# Altium project LegBoard.PrjPcb
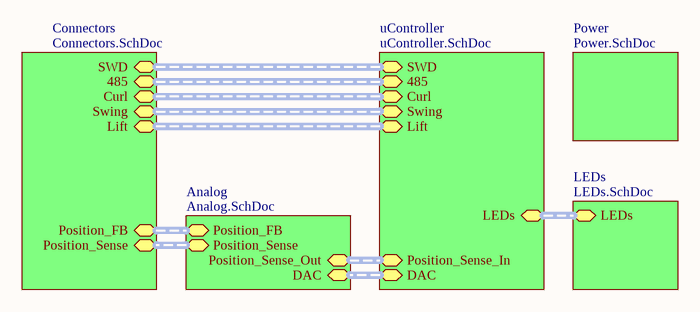
[diagram p0: Main.SchDoc]
5 sheets, 78 parts. Net scope: hierarchical (ports join the sheet entries above them; power ports are global).
Board file: LegBoard.PcbDoc
Sheets:
  Main.SchDoc
    Connectors = Connectors.SchDoc
    uController = uController.SchDoc
    LEDs = LEDs.SchDoc
    Analog = Analog.SchDoc

## Sheet Main.SchDoc
size A

### Sub-sheets
Analog = Analog.SchDoc: Position_FB (harness FB_Harness), Position_Sense (harness FB_Harness), Position_Sense_Out (harness FB_Harness), DAC
Connectors = Connectors.SchDoc: SWD (harness SWD_Harness), Position_FB (harness FB_Harness), Curl (harness Actuator_Harness), Swing (harness Actuator_Harness), Lift (harness Actuator_Harness), 485 (harness 485_Harness), Position_Sense (harness FB_Harness)
LEDs = LEDs.SchDoc: LEDs (harness LED_Harness)
Power = Power.SchDoc (file not in this document): no entries
uController = uController.SchDoc: SWD (harness SWD_Harness), Curl (harness Actuator_Harness), Swing (harness Actuator_Harness), Lift (harness Actuator_Harness), 485 (harness 485_Harness), LEDs (harness LED_Harness), Position_Sense_In, DAC (harness DAC_Harness)

### Buses and harness runs
harness sheet Analog/DAC = sheet uController/DAC
harness sheet Analog/Position_FB = sheet Connectors/Position_FB
harness sheet Analog/Position_Sense = sheet Connectors/Position_Sense
harness sheet Analog/Position_Sense_Out = sheet uController/Position_Sense_In
harness sheet Connectors/485 = sheet uController/485
harness sheet Connectors/Curl = sheet uController/Curl
harness sheet Connectors/Lift = sheet uController/Lift
harness sheet Connectors/SWD = sheet uController/SWD
harness sheet Connectors/Swing = sheet uController/Swing
harness sheet LEDs/LEDs = sheet uController/LEDs

## Sheet Connectors.SchDoc
size A
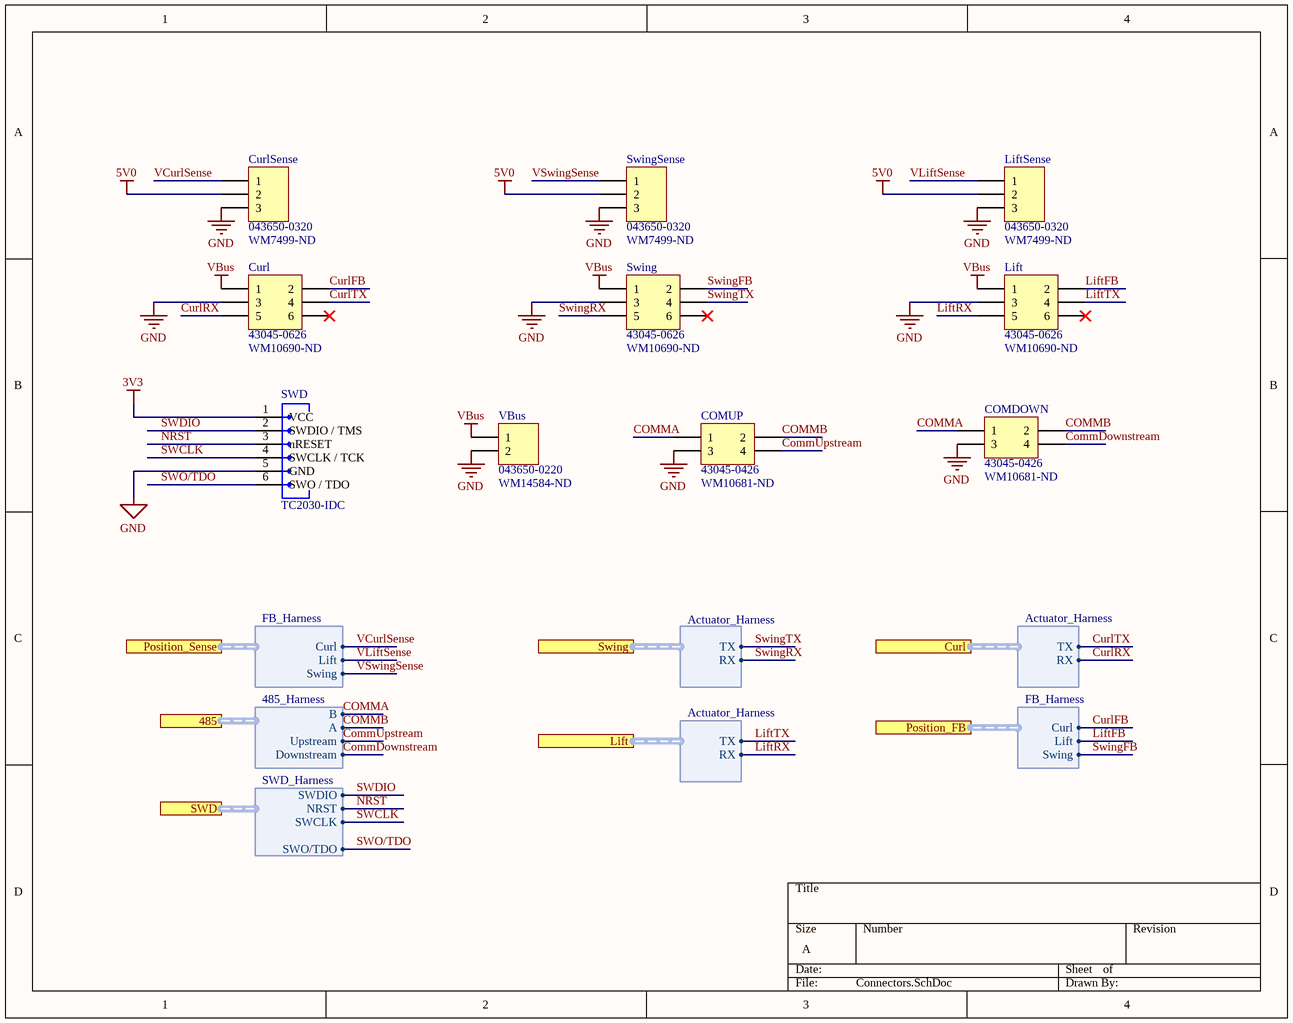
[diagram p1: Connectors.SchDoc]

### Parts
COMDOWN  43045-0426  Vendor PN: WM10681-ND  [43045-0426]
COMUP  43045-0426  Vendor PN: WM10681-ND  [43045-0426]
Curl  43045-0626  Vendor PN: WM10690-ND  [43045-0626]
CurlSense  043650-0320  Vendor PN: WM7499-ND  [43650-0320]
Lift  43045-0626  Vendor PN: WM10690-ND  [43045-0626]
LiftSense  043650-0320  Vendor PN: WM7499-ND  [43650-0320]
SWD  TC2030-IDC  [TC2030-MCP]
Swing  43045-0626  Vendor PN: WM10690-ND  [43045-0626]
SwingSense  043650-0320  Vendor PN: WM7499-ND  [43650-0320]
VBus  043650-0220  Vendor PN: WM14584-ND  [43650-0220]

### Ports
485 (harness 485_Harness), Curl (harness Actuator_Harness), Lift (harness Actuator_Harness), Position_FB (harness FB_Harness), Position_Sense (harness FB_Harness), SWD (harness SWD_Harness), Swing (harness Actuator_Harness)

### Harnesses
SWD_Harness: NRST, SWDIO, SWCLK, SWO/TDO
Actuator_Harness: RX, TX
FB_Harness: Lift, Curl, Swing
485_Harness: A, B, Upstream, Downstream

### Nets
3V3: SWD.1(VCC)
5V0: CurlSense.2 LiftSense.2 SwingSense.2
GND: COMDOWN.3 COMUP.3 Curl.3 CurlSense.3 Lift.3 LiftSense.3 SWD.5(GND) Swing.3 SwingSense.3 VBus.2
VBus: Curl.1 Lift.1 Swing.1 VBus.1
COMMA: COMDOWN.1 COMUP.1 ; port 485.B
COMMB: COMDOWN.2 COMUP.2 ; port 485.A
CommDownstream: COMDOWN.4 ; port 485.Downstream
CommUpstream: COMUP.4 ; port 485.Upstream
CurlFB: Curl.2 ; port Position_FB.Curl
CurlRX: Curl.5 ; port Curl.RX
CurlTX: Curl.4 ; port Curl.TX
LiftFB: Lift.2 ; port Position_FB.Lift
LiftRX: Lift.5 ; port Lift.RX
LiftTX: Lift.4 ; port Lift.TX
NRST: SWD.3(nRESET) ; port SWD.NRST
SWCLK: SWD.4(SWCLK_/_TCK) ; port SWD.SWCLK
SWDIO: SWD.2(SWDIO_/_TMS) ; port SWD.SWDIO
SwingFB: Swing.2 ; port Position_FB.Swing
SwingRX: Swing.5 ; port Swing.RX
SwingTX: Swing.4 ; port Swing.TX
SWO/TDO: SWD.6(SWO_/_TDO) ; port SWD.SWO/TDO
VCurlSense: CurlSense.1 ; port Position_Sense.Curl
VLiftSense: LiftSense.1 ; port Position_Sense.Lift
VSwingSense: SwingSense.1 ; port Position_Sense.Swing

Not connected (* = marked no-connect by the designer): Curl 6*; Lift 6*; Swing 6*

### Library data of the parts
COMDOWN COMUP = Header 2X2: Header, 2-Pin, Dual row; LatestRevisionDate: 17-Jul-2002; LatestRevisionNote: Re-released for DXP Platform.; Publisher: Altium Limited
Curl Lift Swing = Header 3X2: Header, 3-Pin, Dual row; LatestRevisionDate: 17-Jul-2002; LatestRevisionNote: Re-released for DXP Platform.; Publisher: Altium Limited
CurlSense LiftSense SwingSense = Header 3: Header, 3-Pin; LatestRevisionDate: 17-Jul-2002; LatestRevisionNote: Re-released for DXP Platform.; Publisher: Altium Limited
SWD = TC2030-IDC: Connector, Pogo-Pin, ARM Cortex; Manufacturer 1: Tag-Connect; Category: Connectors; Manufacturer Part Number 1: TC2030-IDC; DNP: DNP
VBus = Header 2: Header, 2-Pin; LatestRevisionDate: 17-Jul-2002; LatestRevisionNote: Re-released for DXP Platform.; Publisher: Altium Limited

## Sheet uController.SchDoc
size A
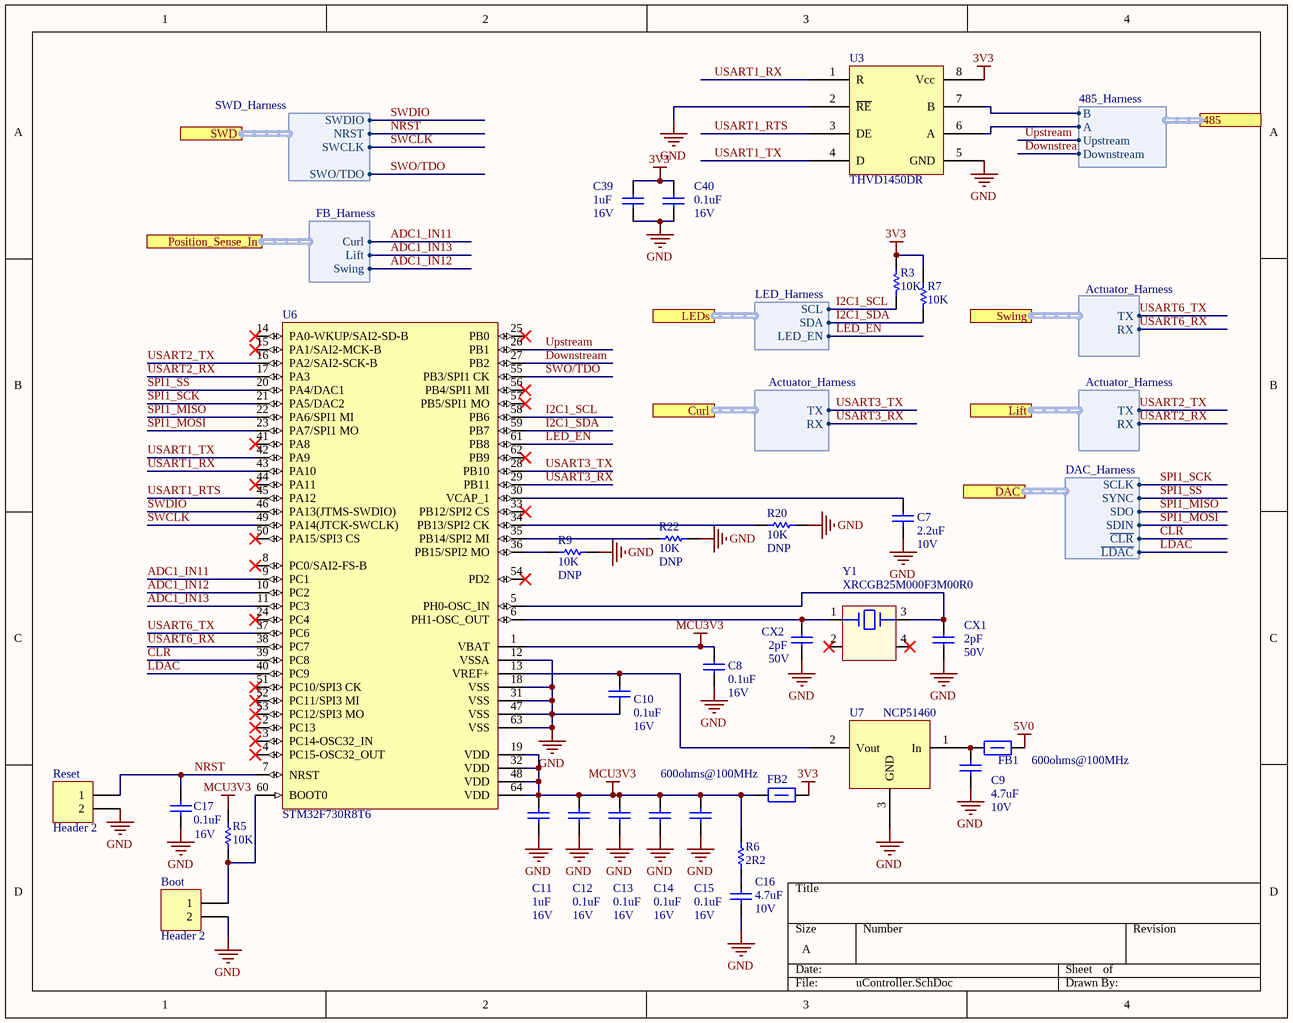
[diagram p2: uController.SchDoc]

### Parts
(Parts that share a designator on the sheet are numbered #1, #2 ... from top to bottom, then left to right.)
Boot  Header 2  [HDR1X2]
C7  2.2uF  Voltage - Rated: 10V  [CAPC1005(0402)N]
C8  0.1uF  Voltage - Rated: 16V  [CAPC1005(0402)N]
C9  4.7uF  Voltage - Rated: 10V  [CAPC1005(0402)N]
C10  0.1uF  Voltage - Rated: 16V  [CAPC1005(0402)N]
C11  1uF  Voltage - Rated: 16V  [CAPC1005(0402)N]
C12  0.1uF  Voltage - Rated: 16V  [CAPC1005(0402)N]
C13  0.1uF  Voltage - Rated: 16V  [CAPC1005(0402)N]
C14  0.1uF  Voltage - Rated: 16V  [CAPC1005(0402)N]
C15  0.1uF  Voltage - Rated: 16V  [CAPC1005(0402)N]
C16  4.7uF  Voltage - Rated: 10V  [CAPC1005(0402)N]
C17  0.1uF  Voltage - Rated: 16V  [CAPC1005(0402)N]
C39  1uF  Voltage - Rated: 16V  [CAPC1005(0402)N]
C40  0.1uF  Voltage - Rated: 16V  [CAPC1005(0402)N]
CX1  2pF  Voltage - Rated: 50V  [CAPC1005(0402)N]
CX2  2pF  Voltage - Rated: 50V  [CAPC1005(0402)N]
FB1  600ohms@100MHz  [INDC1608X100N]
FB2  600ohms@100MHz  [INDC1608X100N]
R3  10K  [RESC1005(0402)N]
R5  10K  [RESC1005(0402)N]
R6  2R2  [RESC1005(0402)N]
R7  10K  [RESC1005(0402)N]
R9  value 10K  [0402]  (hidden comment: Res1)
R20#1  value 10K  [0402]  (hidden comment: Res1)
R22  value 10K  [0402]  (hidden comment: Res1)
Reset  Header 2  [HDR1X2]
U3  THVD1450DR  [SOIC8]
U6  STM32F730R8T6  [STM-LQFP64_V]
U7  NCP51460  [SOT95P237X111-3N]
Y1  XRCGB25M000F3M00R0  [XTAL2x1.6-XRCGB]

### Ports
485 (harness 485_Harness), Curl (harness Actuator_Harness), DAC (harness DAC_Harness), LEDs (harness LED_Harness), Lift (harness Actuator_Harness), Position_Sense_In (harness FB_Harness), SWD (harness SWD_Harness), Swing (harness Actuator_Harness)

### Harnesses
SWD_Harness: NRST, SWDIO, SWCLK, SWO/TDO
485_Harness: A, B, Upstream, Downstream
Actuator_Harness: RX, TX
LED_Harness: SDA, SCL, LED_EN
FB_Harness: Lift, Curl, Swing
DAC_Harness: SDIN, SDO, SCLK, SYNC, ~{CLR}, ~{LDAC}

### Nets
3V3: C39.2 C40.2 FB2.2 R3.2 R7.2 U3.8(Vcc)
5V0: FB1.2
GND: Boot.2 C7.1 C8.1 C9.1 C10.1 C11.1 C12.1 C13.1 C14.1 C15.1 C16.1 C17.1 C39.1 C40.1 CX1.1 CX2.1 R9.2 R20#1.2 R22.2 Reset.2 U3.2(~{RE}) U3.5(GND) U6.12(VSSA) U6.18(VSS) U6.31(VSS) U6.47(VSS) U6.63(VSS) U7.3(GND)
MCU3V3: C8.2 C11.2 C12.2 C13.2 C14.2 C15.2 FB2.1 R5.2 R6.2 U6.1(VBAT) U6.19(VDD) U6.32(VDD) U6.48(VDD) U6.64(VDD)
ADC1_IN11: U6.9(PC1) ; port Position_Sense_In.Curl
ADC1_IN12: U6.10(PC2) ; port Position_Sense_In.Swing
ADC1_IN13: U6.11(PC3) ; port Position_Sense_In.Lift
~{CLR}: U6.39(PC8) ; port DAC.~{CLR}
COMMA: U3.7(B) ; port 485.B
COMMB: U3.6(A) ; port 485.A
Downstream: U6.27(PB2) ; port 485.Downstream  [project net CommDownstream]
I2C1_SCL: R3.1 U6.58(PB6) ; port LEDs.SCL
I2C1_SDA: R7.1 U6.59(PB7) ; port LEDs.SDA
~{LDAC}: U6.40(PC9) ; port DAC.~{LDAC}  [project net DAC_~{LDAC}]
LED_EN: U6.61(PB8) ; port LEDs.LED_EN
NRST: C17.2 Reset.1 U6.7(NRST) ; port SWD.NRST
SPI1_MISO: U6.22(PA6/SPI1_MI) ; port DAC.SDO  [project net DAC_SDO]
SPI1_MOSI: U6.23(PA7/SPI1_MO) ; port DAC.SDIN  [project net DAC_DIN]
SPI1_~{SS}: U6.20(PA4/DAC1) ; port DAC.SYNC  [project net DAC_SYNC]
SPI1_SCK: U6.21(PA5/DAC2) ; port DAC.SCLK  [project net DAC_SCLK]
SWCLK: U6.49(PA14(JTCK-SWCLK)) ; port SWD.SWCLK
SWDIO: U6.46(PA13(JTMS-SWDIO)) ; port SWD.SWDIO
SWO/TDO: U6.55(PB3/SPI1_CK) ; port SWD.SWO/TDO
Upstream: U6.26(PB1) ; port 485.Upstream  [project net CommUpstream]
USART1_RTS: U3.3(DE) U6.45(PA12)
USART1_RX: U3.1(R) U6.43(PA10)
USART1_TX: U3.4(D) U6.42(PA9)
USART2_RX: U6.17(PA3) ; port Lift.RX  [project net LiftRX]
USART2_TX: U6.16(PA2/SAI2-SCK-B) ; port Lift.TX  [project net LiftTX]
USART3_RX: U6.29(PB11) ; port Curl.RX  [project net CurlRX]
USART3_TX: U6.28(PB10) ; port Curl.TX  [project net CurlTX]
USART6_RX: U6.38(PC7) ; port Swing.RX  [project net SwingRX]
USART6_TX: U6.37(PC6) ; port Swing.TX  [project net SwingTX]
NetBoot_1: Boot.1 R5.1 U6.60(BOOT0)
NetC7_2: C7.2 U6.30(VCAP_1)
NetC9_2: C9.2 FB1.1 U7.1(In)
NetC10_2: C10.2 U6.13(VREF+) U7.2(Vout)
NetC16_2: C16.2 R6.1
NetCX1_2: CX1.2 U6.5(PH0-OSC_IN) Y1.3(X3)
NetCX2_2: CX2.2 U6.6(PH1-OSC_OUT) Y1.1(X1)
NetR9_1: R9.1 U6.36(PB15/SPI2_MO)
NetR20#1_1: R20#1.1 U6.34(PB13/SPI2_CK)
NetR22_1: R22.1 U6.35(PB14/SPI2_MI)

Not connected (* = marked no-connect by the designer): U6 2(PC13)* 3(PC14-OSC32_IN)* 4(PC15-OSC32_OUT)* 8(PC0/SAI2-FS-B)* 14(PA0-WKUP/SAI2-SD-B)* 15(PA1/SAI2-MCK-B)* 24(PC4)* 25(PB0)* 33(PB12/SPI2_CS)* 41(PA8)* 44(PA11)* 50(PA15/SPI3_CS)* 51(PC10/SPI3_CK)* 52(PC11/SPI3_MI)* 53(PC12/SPI3_MO)* 54(PD2)* 56(PB4/SPI1_MI)* 57(PB5/SPI1_MO)* 62(PB9)*; Y1 2(GND)* 4(GND)*

### Library data of the parts
Boot Reset = Header 2: Header, 2-Pin; LatestRevisionDate: 17-Jul-2002; LatestRevisionNote: Re-released for DXP Platform.; Publisher: Altium Limited; DNP: DNP
C7 = CAP: Manufacturer 1: Murata; Manufacturer Part Number 1: GRM155R61A225KE95D; Temperature Coefficient: X5R; Tolerance: ±10%; Level: 1; Vendor PN: 490-10451-1-ND; RoHS: RoHS Compliant; Category: Capacitors; Capacitance: 2.2uF; Mounting Type: Surface Mount, MLCC; Operating Temperature: -55°C ~ 85°C; Package / Case: 0402 (1005 Metric); Size / Dimension: 0.039" L x 0.020" W (1.00mm x 0.50mm); Thickness (Max): 0.022" (0.55mm)
C8 = CAP: Manufacturer 1: Murata; Manufacturer Part Number 1: GRM155R61C104KA88D; Temperature Coefficient: X5R; Tolerance: ±10%; Level: 1; Vendor PN: 490-5415-1-ND; RoHS: RoHS Compliant; Category: Capacitors; Capacitance: 0.1uF; Mounting Type: Surface Mount, MLCC; Operating Temperature: -55°C ~ 85°C; Package / Case: 0402 (1005 Metric); Size / Dimension: 0.039" L x 0.020" W (1.00mm x 0.50mm); Thickness (Max): 0.022" (0.55mm)
C9 C16 = CAP: Manufacturer 1: Murata; Manufacturer Part Number 1: GRM155R61A475MEAAD; Temperature Coefficient: X5R; Tolerance: ±10%; Level: 1; Vendor PN: 490-14306-1-ND; RoHS: RoHS Compliant; Category: Capacitors; Capacitance: 4.7uF; Mounting Type: Surface Mount, MLCC; Operating Temperature: -55°C ~ 85°C; Package / Case: 0402 (1005 Metric); Size / Dimension: 0.039" L x 0.020" W (1.00mm x 0.50mm); Thickness (Max): 0.022" (0.55mm)
C10 C12-C15 C17 C40 = CAP: CAP CER 0.1UF 16V X5R 0402; Manufacturer 1: Murata; Manufacturer Part Number 1: GRM155R61C104KA88D; Tolerance: ±10%; Level: 1; Vendor PN: 490-5415-1-ND; Temperature Coefficient: X5R; RoHS: RoHS Compliant; Category: Capacitors; Capacitance: 0.1uF; Mounting Type: Surface Mount, MLCC; Operating Temperature: -55°C ~ 85°C; Package / Case: 0402 (1005 Metric); Size / Dimension: 0.039" L x 0.020" W (1.00mm x 0.50mm); Thickness (Max): 0.022" (0.55mm)
C11 C39 = CAP: Manufacturer 1: Samsung; Manufacturer Part Number 1: CL05A105KO5NNNC; Tolerance: ±10%; Level: 1; Vendor PN: 1276-1067-1-ND; RoHS: RoHS Compliant; Category: Capacitors; Capacitance: 1uF; Mounting Type: Surface Mount, MLCC; Operating Temperature: -55°C ~ 85°C; Package / Case: 0402 (1005 Metric); Size / Dimension: 0.039" L x 0.020" W (1.00mm x 0.50mm); Thickness (Max): 0.022" (0.55mm)
CX1 CX2 = CAP: CAP C0G/NP0; Manufacturer 1: Yageo; Manufacturer Part Number 1: CC0402CRNPO9BN2R0; Temperature Coefficient: X5R; Tolerance: ±10%; Level: 1; Vendor PN: 311-1006-1-ND; RoHS: RoHS Compliant; Category: Capacitors; Capacitance: 2pF; Mounting Type: Surface Mount, MLCC; Operating Temperature: -55°C ~ 85°C; Package / Case: 0402 (1005 Metric); Size / Dimension: 0.039" L x 0.020" W (1.00mm x 0.50mm); Thickness (Max): 0.022" (0.55mm)
FB1 FB2 = IND-FERRITE: Inductor, ferrite bead, 1608; Manufacturer 1: Murata; Manufacturer Part Number 1: BLM18KG601SN1D; Tolerance: 20%; DC Resistance (DCR): 150mR; Max DC Current: 1.3A; Test Frequency: 100MHz; Vendor PN: 490-5258-1-ND; Case/Package: 0603; Case Code (Metric): 1608; Impedance: 600ohms@100MHz; Termination: SMD/SMT; Composition: ferrite; Lead Free: Lead Free; Category: inductors; Package / Case: 0603 (1608 Metric)
R3 R5 R7 = RES: Resistor, Chip; Manufacturer 1: Stackpole; Manufacturer Part Number 1: RMCF0402FT10K0; Level: 1; Vendor PN: RMCF0402FT10K0CT-ND; Category: Resistors; Number of Terminations: 2; Composition: -; Power (Watts): -; Resistance: 10K; Temperature Coefficient: -; Tolerance: -; Package / Case: 0402 (1005 Metric)
R6 = RES: Resistor, Chip; Manufacturer 1: Stackpole; Manufacturer Part Number 1: RMCF0402FT2R20; Level: 1; Vendor PN: RMCF0402FT2R20CT-ND; Category: Resistors; Number of Terminations: 2; Composition: -; Power (Watts): -; Resistance: 2R2; Temperature Coefficient: -; Tolerance: -; Package / Case: 0402 (1005 Metric)
R9 R20#1 R22 = Res1: Resistor; Vendor PN: RMCF0402FT10K0CT-ND; Published: 8-Jun-2000; LatestRevisionDate: 17-Jul-2002; LatestRevisionNote: Re-released for DXP Platform.; PackageReference: AXIAL-0.3; Publisher: Altium Limited; PackageDescription: Axial Device, Thru-Hole; 2 Leads; 0.3 in Pin Spacing; DNP: DNP
U3 = THVD1450DR: Vendor PN: 296-50395-1-ND
U6 = STM32F730R8T6: IC, Cortex-M7 32b MCU+FPU, 462DMIPS, 64KB Flash / /256+16+4KB RAM, 64 pin LQFP; Manufacturer 1: STMicro; Vendor PN: 497-18103-ND; Manufacturer Part Number 1: STM32F730R8T6; Category: ICs
U7 = NCP51460: Vendor PN: NCP51460SN33T1GOSCT-ND
Y1 = XTAL01: Crystal, Murata  XRCGB25M000F3M00R0; Value: 25MHz; Vendor Pn: 490-5578-1-ND; Manufacturer 1: Murata; Manufacturer Part Number 1: XRCGB25M000F3M00R0; Category: frequency control

## Sheet LEDs.SchDoc
size A
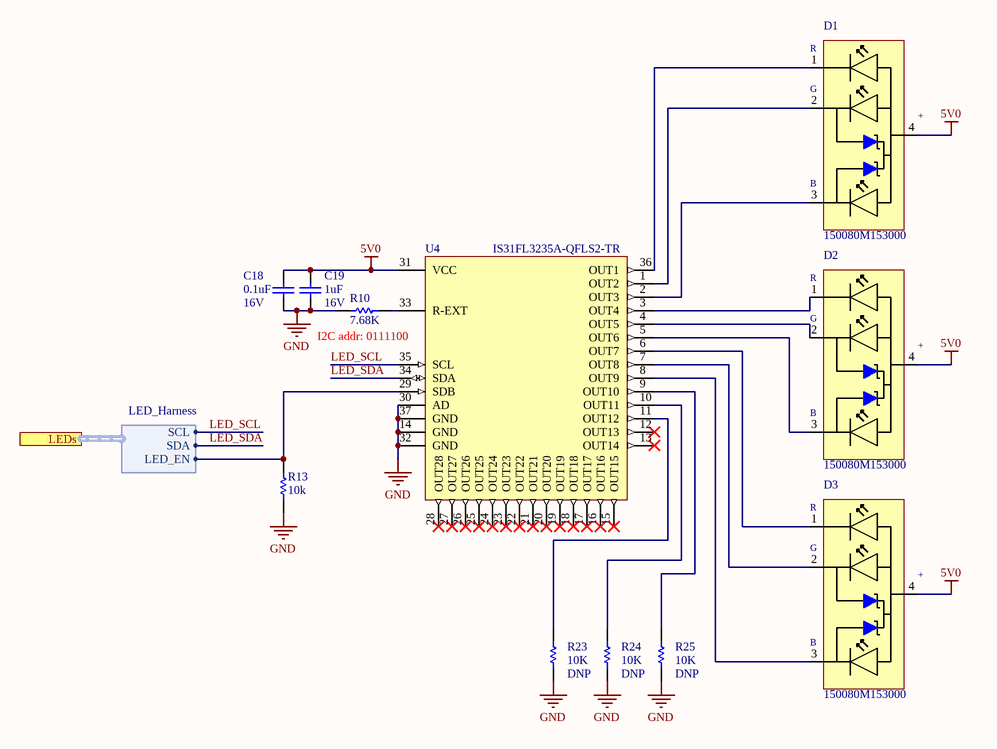
[diagram p3: LEDs.SchDoc]

### Parts
C18  0.1uF  Voltage - Rated: 16V  [CAPC1005(0402)N]
C19  1uF  Voltage - Rated: 16V  [CAPC1005(0402)N]
D1  150080M153000  [*LED_150080M153000]
D2  150080M153000  [*LED_150080M153000]
D3  150080M153000  [*LED_150080M153000]
R10  7.68K  [RESC1005(0402)N]
R13  10k  [RESC1005(0402)N]
R23  value 10K  [0402]  (hidden comment: Res1)
R24  value 10K  [0402]  (hidden comment: Res1)
R25  value 10K  [0402]  (hidden comment: Res1)
U4  IS31FL3235A-QFLS2-TR  [QFN40P400X400X80_HS-37N]

### Ports
LEDs (harness LED_Harness)

### Harnesses
LED_Harness: SDA, SCL, LED_EN

### Nets
5V0: C18.2 C19.2 D1.4(A) D2.4(A) D3.4(A) U4.31(VCC)
GND: C18.1 C19.1 R10.1 R13.1 R23.1 R24.1 R25.1 U4.14(GND) U4.30(AD) U4.32(GND) U4.37(GND)
LED_EN: R13.2 U4.29(SDB) ; port LEDs.LED_EN
LED_SCL: U4.35(SCL) ; port LEDs.SCL  [project net I2C1_SCL]
LED_SDA: U4.34(SDA) ; port LEDs.SDA  [project net I2C1_SDA]
NetD1_1: D1.1(R) U4.36(OUT1)
NetD1_2: D1.2(G) U4.1(OUT2)
NetD1_3: D1.3(B) U4.2(OUT3)
NetD2_1: D2.1(R) U4.3(OUT4)
NetD2_2: D2.2(G) U4.4(OUT5)
NetD2_3: D2.3(B) U4.5(OUT6)
NetD3_1: D3.1(R) U4.6(OUT7)
NetD3_2: D3.2(G) U4.7(OUT8)
NetD3_3: D3.3(B) U4.8(OUT9)
NetR10_2: R10.2 U4.33(R-EXT)
NetR23_2: R23.2 U4.11(OUT12)
NetR24_2: R24.2 U4.10(OUT11)
NetR25_2: R25.2 U4.9(OUT10)

Not connected (* = marked no-connect by the designer): U4 12(OUT13)* 13(OUT14)* 15(OUT15)* 16(OUT16)* 17(OUT17)* 18(OUT18)* 19(OUT19)* 20(OUT20)* 21(OUT21)* 22(OUT22)* 23(OUT23)* 24(OUT24)* 25(OUT25)* 26(OUT26)* 27(OUT27)* 28(OUT28)*

### Notes on the sheet
- (near U4) I2C addr: 0111100
- (in symbol 150080M153000) +

### Library data of the parts
C18 = CAP: as C10 on sheet uController; Temperature Coefficient: X5R; RoHS: RoHS Compliant; Category: Capacitors; Capacitance: 0.1uF; Mounting Type: Surface Mount, MLCC; Operating Temperature: -55°C ~ 85°C; Package / Case: 0402 (1005 Metric); Size / Dimension: 0.039" L x 0.020" W (1.00mm x 0.50mm); Thickness (Max): 0.022" (0.55mm)
C19 = CAP: Manufacturer 1: Samsung; Manufacturer Part Number 1: CL05A105KO5NNNC; Temperature Coefficient: X5R; Tolerance: ±10%; Level: 1; Vendor PN: 1276-1067-1-ND; RoHS: RoHS Compliant; Category: Capacitors; Capacitance: 1uF; Mounting Type: Surface Mount, MLCC; Operating Temperature: -55°C ~ 85°C; Package / Case: 0402 (1005 Metric); Size / Dimension: 0.039" L x 0.020" W (1.00mm x 0.50mm); Thickness (Max): 0.022" (0.55mm)
D1-D3 = 150080M153000: Red, Green, Blue _RGB_ 624nm Red, 525nm Green, 470nm Blue LED Indication - Discrete 2V Red, 3.3V Green, 3.3V Blue 4-SMD, No Lead; MF: Wurth Electronics; Vendor PN: 732-11392-1-ND; SnapEDA_Link: https://www.snapeda.com/parts/150080M153000/Wurth%20Electronics%20Inc./view-part/2747771/?ref=snap; Availability: Unavailable; Price: None; MP: 150080M153000; Package: SMD-4 WÃ¼rth Elektronik; Value: *
R10 = RES: Resistor, Chip; Manufacturer 1: Stackpole; Manufacturer Part Number 1: RMCF0402FT7K68; Level: 1; Vendor PN: RMCF0402FT7K68CT-ND; Category: Resistors; Number of Terminations: 2; Composition: -; Power (Watts): -; Resistance: 7.68K; Temperature Coefficient: -; Tolerance: -; Package / Case: 0402 (1005 Metric)
R13 = RES: as R3 on sheet uController; Category: Resistors; Number of Terminations: 2; Composition: -; Power (Watts): -; Resistance: 10k; Temperature Coefficient: -; Tolerance: -; Package / Case: 0402 (1005 Metric); DNP: *
R23-R25 = Res1: Resistor; Vendor PN: 311-10.0KLRCT-ND; Published: 8-Jun-2000; LatestRevisionDate: 17-Jul-2002; LatestRevisionNote: Re-released for DXP Platform.; PackageReference: AXIAL-0.3; Publisher: Altium Limited; PackageDescription: Axial Device, Thru-Hole; 2 Leads; 0.3 in Pin Spacing; DNP: DNP
U4 = IS31FL3235A-QFLS2-TR: 28 channel LED Driver; Manufacturer 1: ISSI; Vendor PN: 706-1588-1-ND; Manufacturer Part Number 1: IS31FL3235A-QFLS2-TR

## Sheet Analog.SchDoc
size A
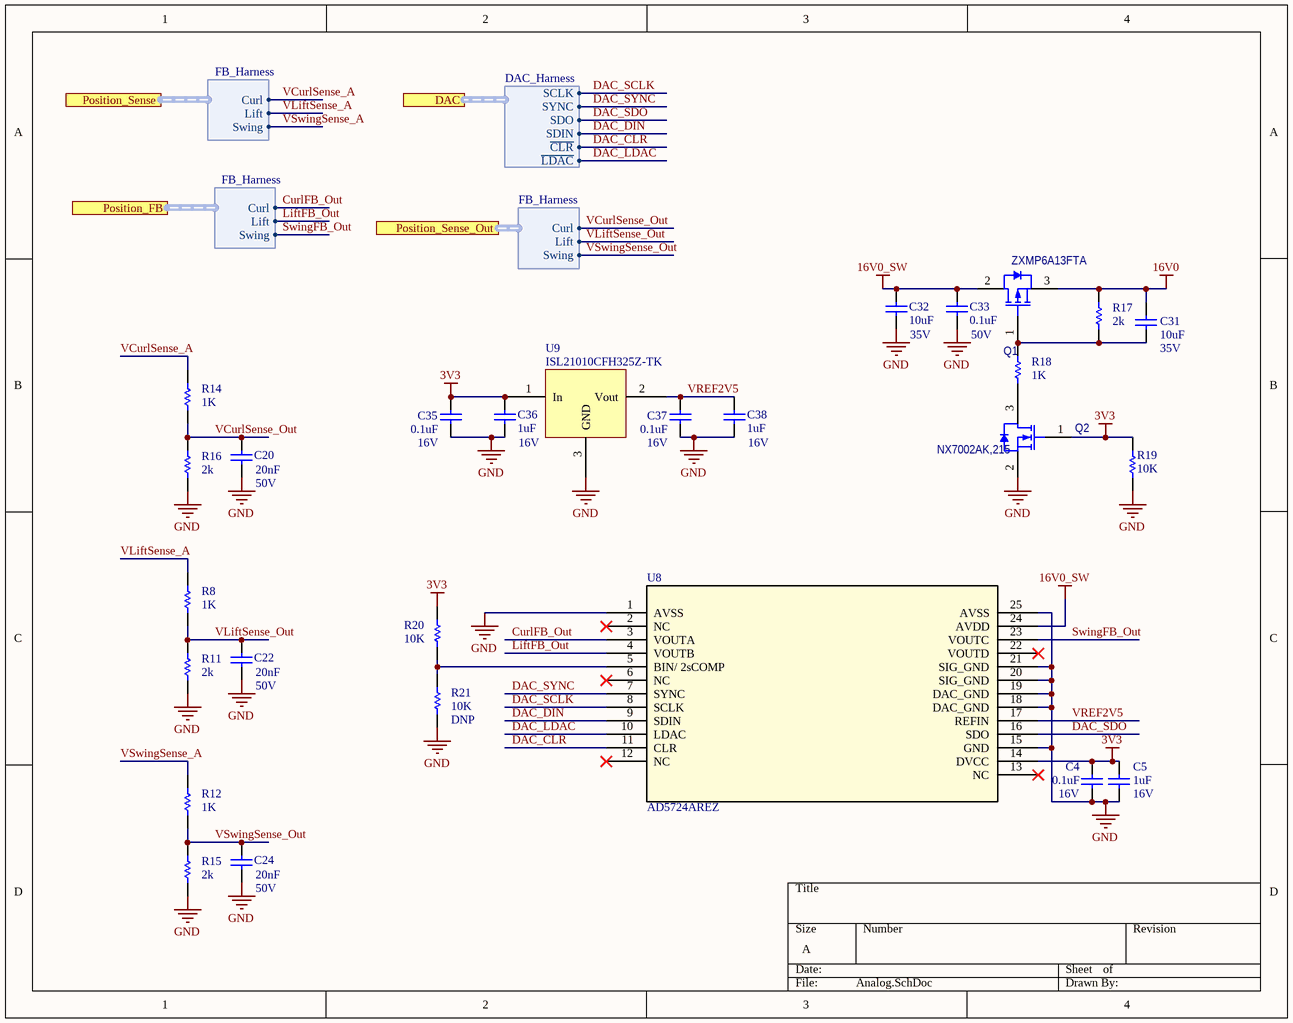
[diagram p4: Analog.SchDoc]

### Parts
(Parts that share a designator on the sheet are numbered #1, #2 ... from top to bottom, then left to right.)
C4  0.1uF  Voltage - Rated: 16V  [CAPC1005(0402)N]
C5  1uF  Voltage - Rated: 16V  [CAPC1005(0402)N]
C20  value 20nF  Voltage - Rated: 50V  [0402]  (hidden comment: Cap)
C22  value 20nF  Voltage - Rated: 50V  [0402]  (hidden comment: Cap)
C24  value 20nF  Voltage - Rated: 50V  [0402]  (hidden comment: Cap)
C31  10uF  Voltage - Rated: 35V  [CAPC2012X145N]
C32  10uF  Voltage - Rated: 35V  [CAPC2012X145N]
C33  0.1uF  Voltage - Rated: 50V  [CAPC1005(0402)N]
C35  0.1uF  Voltage - Rated: 16V  [CAPC1005(0402)N]
C36  1uF  Voltage - Rated: 16V  [CAPC1005(0402)N]
C37  0.1uF  Voltage - Rated: 16V  [CAPC1005(0402)N]
C38  1uF  Voltage - Rated: 16V  [CAPC1005(0402)N]
Q1  ZXMP6A13FTA  [*SOT95P230X110-3P]
Q2  NX7002AK,215  [*SOT95P230X110-3N]
R8  value 1K  [0402]  (hidden comment: Res1)
R11  value 2k  [0402]  (hidden comment: Res1)
R12  value 1K  [0402]  (hidden comment: Res1)
R14  value 1K  [0402]  (hidden comment: Res1)
R15  value 2k  [0402]  (hidden comment: Res1)
R16  value 2k  [0402]  (hidden comment: Res1)
R17  value 2k  [0402]  (hidden comment: Res1)
R18  value 1K  [0402]  (hidden comment: Res1)
R19  10K  [RESC1005(0402)N]
R20#2  value 10K  [0402]  (hidden comment: Res1)
R21  value 10K  [0402]  (hidden comment: Res1)
U8  AD5724AREZ  [RE_24]
U9  ISL21010CFH325Z-TK  [SOT95P237X111-3N]

### Ports
DAC (harness DAC_Harness), Position_FB (harness FB_Harness), Position_Sense (harness FB_Harness), Position_Sense_Out (harness FB_Harness)

### Harnesses
FB_Harness: Lift, Curl, Swing
DAC_Harness: SDIN, SDO, SCLK, SYNC, ~{CLR}, ~{LDAC}

### Nets
3V3: C4.2 C5.2 C35.2 C36.2 Q2.1(G1) R19.2 R20#2.2 U8.14(DVCC) U9.1(In)
16V0: C31.2 Q1.3(S1) R17.2
16V0_SW: C32.1 C33.2 Q1.2(D1) U8.24(AVDD)
GND: C4.1 C5.1 C20.1 C22.1 C24.1 C32.2 C33.1 C35.1 C36.1 C37.1 C38.1 Q2.2(S1) R11.1 R15.1 R16.1 R19.1 R21.1 U8.1(AVSS) U8.15(GND) U8.18(DAC_GND) U8.19(DAC_GND) U8.20(SIG_GND) U8.21(SIG_GND) U8.25(AVSS) U9.3(GND)
CurlFB_Out: U8.3(VOUTA) ; port Position_FB.Curl  [project net CurlFB]
DAC_~{CLR}: U8.11(CLR) ; port DAC.~{CLR}  [project net ~{CLR}]
DAC_DIN: U8.9(SDIN) ; port DAC.SDIN
DAC_~{LDAC}: U8.10(LDAC) ; port DAC.~{LDAC}
DAC_SCLK: U8.8(SCLK) ; port DAC.SCLK
DAC_SDO: U8.16(SDO) ; port DAC.SDO
DAC_SYNC: U8.7(SYNC) ; port DAC.SYNC
LiftFB_Out: U8.4(VOUTB) ; port Position_FB.Lift  [project net LiftFB]
SwingFB_Out: U8.23(VOUTC) ; port Position_FB.Swing  [project net SwingFB]
VCurlSense_A: R14.2 ; port Position_Sense.Curl  [project net VCurlSense]
VCurlSense_Out: C20.2 R14.1 R16.2 ; port Position_Sense_Out.Curl  [project net ADC1_IN11]
VLiftSense_A: R8.2 ; port Position_Sense.Lift  [project net VLiftSense]
VLiftSense_Out: C22.2 R8.1 R11.2 ; port Position_Sense_Out.Lift  [project net ADC1_IN13]
VREF2V5: C37.2 C38.2 U8.17(REFIN) U9.2(Vout)
VSwingSense_A: R12.2 ; port Position_Sense.Swing  [project net VSwingSense]
VSwingSense_Out: C24.2 R12.1 R15.2 ; port Position_Sense_Out.Swing  [project net ADC1_IN12]
NetC31_1: C31.1 Q1.1(G1) R17.1 R18.2
NetQ2_3: Q2.3(D1) R18.1
NetR20#2_1: R20#2.1 R21.2 U8.5(BIN/_2sCOMP)

Not connected (* = marked no-connect by the designer): U8 2(NC)* 6(NC)* 12(NC)* 13(NC)* 22(VOUTD)*

### Library data of the parts
C4 C35 C37 = CAP: as C10 on sheet uController; Temperature Coefficient: X5R; RoHS: RoHS Compliant; Category: Capacitors; Capacitance: 0.1uF; Mounting Type: Surface Mount, MLCC; Operating Temperature: -55°C ~ 85°C; Package / Case: 0402 (1005 Metric); Size / Dimension: 0.039" L x 0.020" W (1.00mm x 0.50mm); Thickness (Max): 0.022" (0.55mm)
C5 C36 C38 = CAP: as C19 on sheet LEDs; RoHS: RoHS Compliant; Category: Capacitors; Capacitance: 1uF; Mounting Type: Surface Mount, MLCC; Operating Temperature: -55°C ~ 85°C; Package / Case: 0402 (1005 Metric); Size / Dimension: 0.039" L x 0.020" W (1.00mm x 0.50mm); Thickness (Max): 0.022" (0.55mm)
C20 C22 C24 = Cap: Capacitor; Vendor PN: 478-10122-1-ND; Published: 8-Jun-2000; LatestRevisionDate: 17-Jul-2002; LatestRevisionNote: Re-released for DXP Platform.; PackageReference: RAD-0.3; Publisher: Altium Limited; PackageDescription: Radial Cap, Thru-Hole; 2 Leads; 0.3 in Pin Spacing
C31 C32 = CAP: Manufacturer 1: Samsung; Manufacturer Part Number 1: GRM21BC8YA106ME11L; Tolerance: ±10%; Level: 1; Vendor PN: 490-10505-1-ND; RoHS: RoHS Compliant; Category: Capacitors; Capacitance: 10uF; Mounting Type: Surface Mount, MLCC; Operating Temperature: -55°C ~ 85°C; Package / Case: 0805 (2012 Metric); Size / Dimension: 0.039" L x 0.020" W (1.00mm x 0.50mm); Thickness (Max): 0.022" (0.55mm)
C33 = CAP: CAP CER 0.1UF 16V X5R 0402; Manufacturer 1: Murata; Manufacturer Part Number 1: GRM155R71H104KE14J; Tolerance: ±10%; Level: 1; Vendor PN: 490-13342-1-ND; Temperature Coefficient: X5R; RoHS: RoHS Compliant; Category: Capacitors; Capacitance: 0.1uF; Mounting Type: Surface Mount, MLCC; Operating Temperature: -55°C ~ 85°C; Package / Case: 0402 (1005 Metric); Size / Dimension: 0.039" L x 0.020" W (1.00mm x 0.50mm); Thickness (Max): 0.022" (0.55mm)
Q1 = RZM001P02T2L: MOSFET P-CH 20V 0.1A VMT3; Manufacturer 1: Diodes Inc; Vendor PN: ZXMP6A13FCT-ND; ComponentLink1Description: Datasheet; ComponentLink1URL: https://www.rohm.com/datasheet/RZM001P02/rzm001p02t2l-e; Category: MOSFETs; Manufacturer Part Number 1: ZXMP6A13FTA
Q2 = NX7002AKVL: MOSFET 60 V, Single N-chan Trench; Manufacturer 1: Nexperia; Vendor PN: 1727-1289-1-ND; Manufacturer Part Number 1: NX7002AK,215; ComponentLink1Description: Datasheet; ComponentLink1URL: https://assets.nexperia.com/documents/data-sheet/NX7002AK.pdf; Category: MOSFETs
R8 R12 R14 R18 = Res1: Resistor; Vendor PN: 311-1.00KLRCT-ND; Published: 8-Jun-2000; LatestRevisionDate: 17-Jul-2002; LatestRevisionNote: Re-released for DXP Platform.; PackageReference: AXIAL-0.3; Publisher: Altium Limited; PackageDescription: Axial Device, Thru-Hole; 2 Leads; 0.3 in Pin Spacing; DNP: *
R11 R15-R17 = Res1: Resistor; Vendor PN: 311-2KLRCT-ND; Published: 8-Jun-2000; LatestRevisionDate: 17-Jul-2002; LatestRevisionNote: Re-released for DXP Platform.; PackageReference: AXIAL-0.3; Publisher: Altium Limited; PackageDescription: Axial Device, Thru-Hole; 2 Leads; 0.3 in Pin Spacing; DNP: *
R19 = RES: as R3 on sheet uController; Category: Resistors; Number of Terminations: 2; Composition: -; Power (Watts): -; Resistance: 10K; Temperature Coefficient: -; Tolerance: -; Package / Case: 0402 (1005 Metric)
R20#2 = Res1: Resistor; Vendor PN: RMCF0402FT10K0CT-ND; Published: 8-Jun-2000; LatestRevisionDate: 17-Jul-2002; LatestRevisionNote: Re-released for DXP Platform.; PackageReference: AXIAL-0.3; Publisher: Altium Limited; PackageDescription: Axial Device, Thru-Hole; 2 Leads; 0.3 in Pin Spacing; DNP: *
R21 = Res1: Resistor; Vendor PN: 311-10.0KLRCT-ND; Published: 8-Jun-2000; LatestRevisionDate: 17-Jul-2002; LatestRevisionNote: Re-released for DXP Platform.; PackageReference: AXIAL-0.3; Publisher: Altium Limited; PackageDescription: Axial Device, Thru-Hole; 2 Leads; 0.3 in Pin Spacing; DNP: DNP
U8 = AD5724AREZ: No Description Available; Vendor: Analog Devices Inc; Built_By: EMA_UL_Team; Vendor PN: AD5724AREZ-REEL7CT-ND; Manufacturer_Part_Number: AD5724AREZ; Copyright: Copyright (C) 2018 Accelerated Designs. All rights reserved; RefDes: RefDes; Type: DEV; Value: Value
U9 = ISL21010CFH325Z-TK: Vendor PN: ISL21010CFH325Z-TKCT-ND

## Nets that join several sheets
3V3: Connectors (SWD.1), uController (6 pins), Analog (9 pins)
5V0: Connectors (CurlSense.2 LiftSense.2 SwingSense.2), uController (FB1.2), LEDs (6 pins)
GND: Connectors (10 pins), uController (28 pins), LEDs (11 pins), Analog (25 pins)
ADC1_IN11: uController (U6.9), Analog (C20.2 R14.1 R16.2)
ADC1_IN12: uController (U6.10), Analog (C24.2 R12.1 R15.2)
ADC1_IN13: uController (U6.11), Analog (C22.2 R8.1 R11.2)
~{CLR}: uController (U6.39), Analog (U8.11)
COMMA: Connectors (COMDOWN.1 COMUP.1), uController (U3.7)
COMMB: Connectors (COMDOWN.2 COMUP.2), uController (U3.6)
CommDownstream: Connectors (COMDOWN.4), uController (U6.27)
CommUpstream: Connectors (COMUP.4), uController (U6.26)
CurlFB: Connectors (Curl.2), Analog (U8.3)
CurlRX: Connectors (Curl.5), uController (U6.29)
CurlTX: Connectors (Curl.4), uController (U6.28)
DAC_DIN: uController (U6.23), Analog (U8.9)
DAC_~{LDAC}: uController (U6.40), Analog (U8.10)
DAC_SCLK: uController (U6.21), Analog (U8.8)
DAC_SDO: uController (U6.22), Analog (U8.16)
DAC_SYNC: uController (U6.20), Analog (U8.7)
I2C1_SCL: uController (R3.1 U6.58), LEDs (U4.35)
I2C1_SDA: uController (R7.1 U6.59), LEDs (U4.34)
LED_EN: uController (U6.61), LEDs (R13.2 U4.29)
LiftFB: Connectors (Lift.2), Analog (U8.4)
LiftRX: Connectors (Lift.5), uController (U6.17)
LiftTX: Connectors (Lift.4), uController (U6.16)
NRST: Connectors (SWD.3), uController (C17.2 Reset.1 U6.7)
SWCLK: Connectors (SWD.4), uController (U6.49)
SWDIO: Connectors (SWD.2), uController (U6.46)
SwingFB: Connectors (Swing.2), Analog (U8.23)
SwingRX: Connectors (Swing.5), uController (U6.38)
SwingTX: Connectors (Swing.4), uController (U6.37)
SWO/TDO: Connectors (SWD.6), uController (U6.55)
VCurlSense: Connectors (CurlSense.1), Analog (R14.2)
VLiftSense: Connectors (LiftSense.1), Analog (R8.2)
VSwingSense: Connectors (SwingSense.1), Analog (R12.2)